# EAGLE design lamp-a-1 (EAGLE 9.6.2)
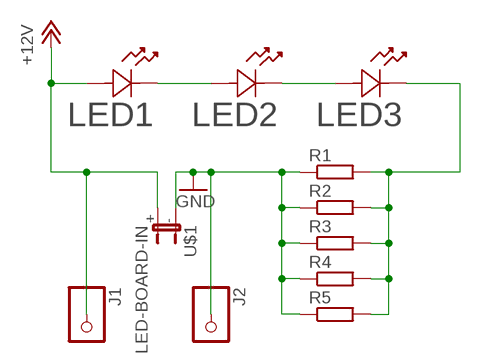
[diagram p0: schematic, sheet 1]

## Parts
J1  LARGE-SOLDERPAD  [LARGE-SOLDERPAD]
J2  LARGE-SOLDERPAD  [LARGE-SOLDERPAD]
LED1  LED-2835LED_J2835_CRW-M  [LED_J2835_CRW-M]
LED2  LED-2835LED_J2835_CRW-M  [LED_J2835_CRW-M]
LED3  LED-2835LED_J2835_CRW-M  [LED_J2835_CRW-M]
R1  R-EU_R0805  [R0805]
R2  R-EU_R0805  [R0805]
R3  R-EU_R0805  [R0805]
R4  R-EU_R0805  [R0805]
R5  R-EU_R0805  [R0805]
U$1  LED-BOARD-IN  [LED-BOARD-IN]

## Nets
+12V: J1.P$1 LED1.2 U$1.+
GND: J2.P$1 R1.1 R2.1 R3.1 R4.1 R5.1 U$1.-
N$1: LED1.1 LED2.2
N$2: LED2.1 LED3.2
N$4: LED3.1 R1.2 R2.2 R3.2 R4.2 R5.2

## Library data of the parts
J1 J2 = eagleparts:LARGE-SOLDERPAD
LED1-LED3 = eagleparts:LED-2835; COPYRIGHT: Copyright (C) 2024 Ultra Librarian. All rights reserved.; MANUFACTURER_PART_NUMBER: JB2835AWT-W-U30GA0000-N0000001; MFR_NAME: Wolfspeed
R1-R5 = rcl:R-EU_: RESISTOR, European symbol; SPICEPREFIX: R
U$1 = eagleparts:LED-BOARD-IN

## Board
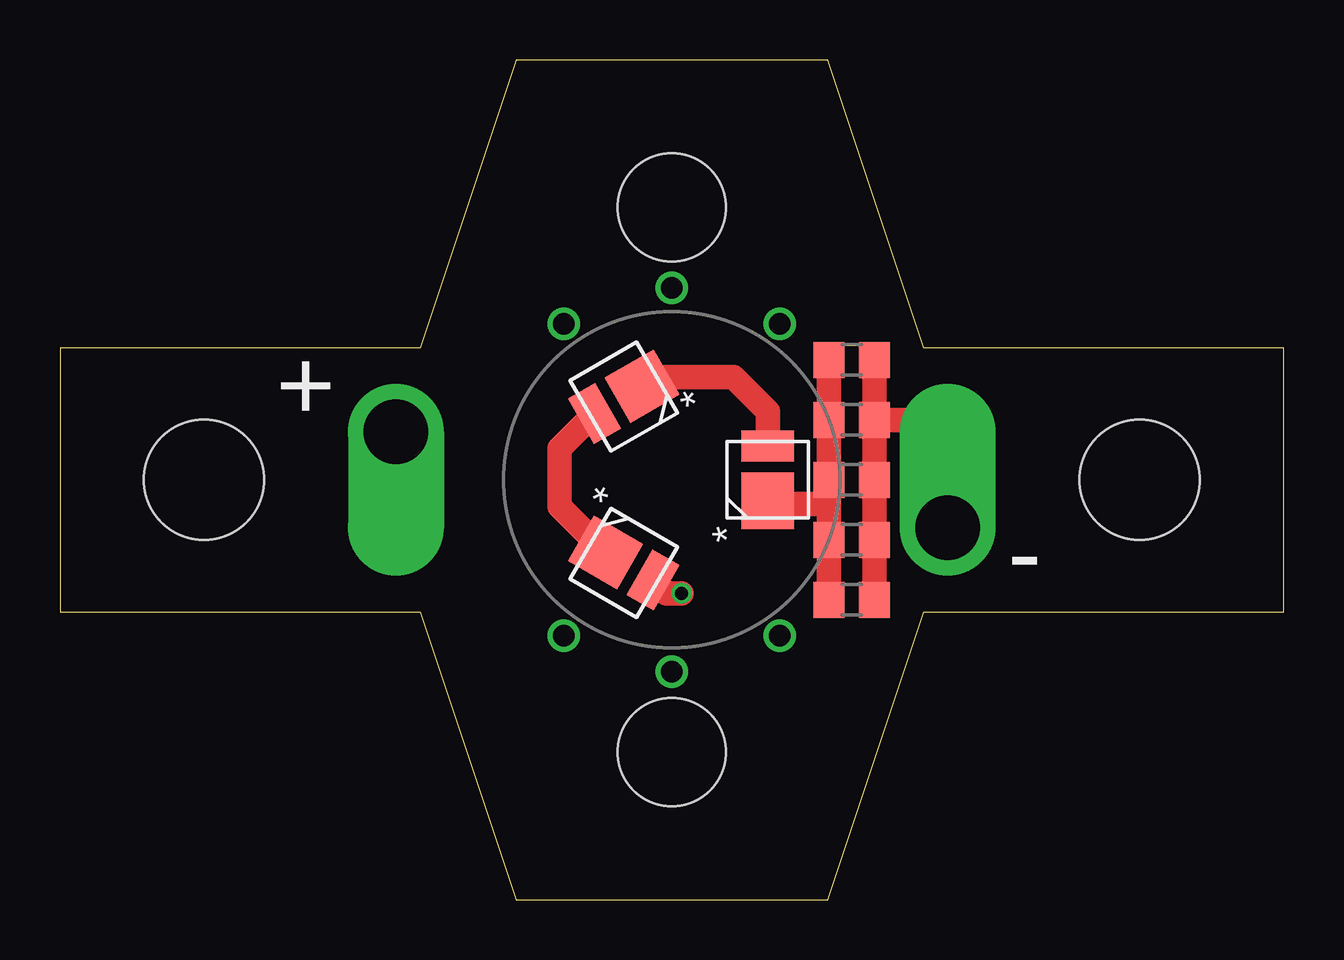
[diagram p1: board, top side]
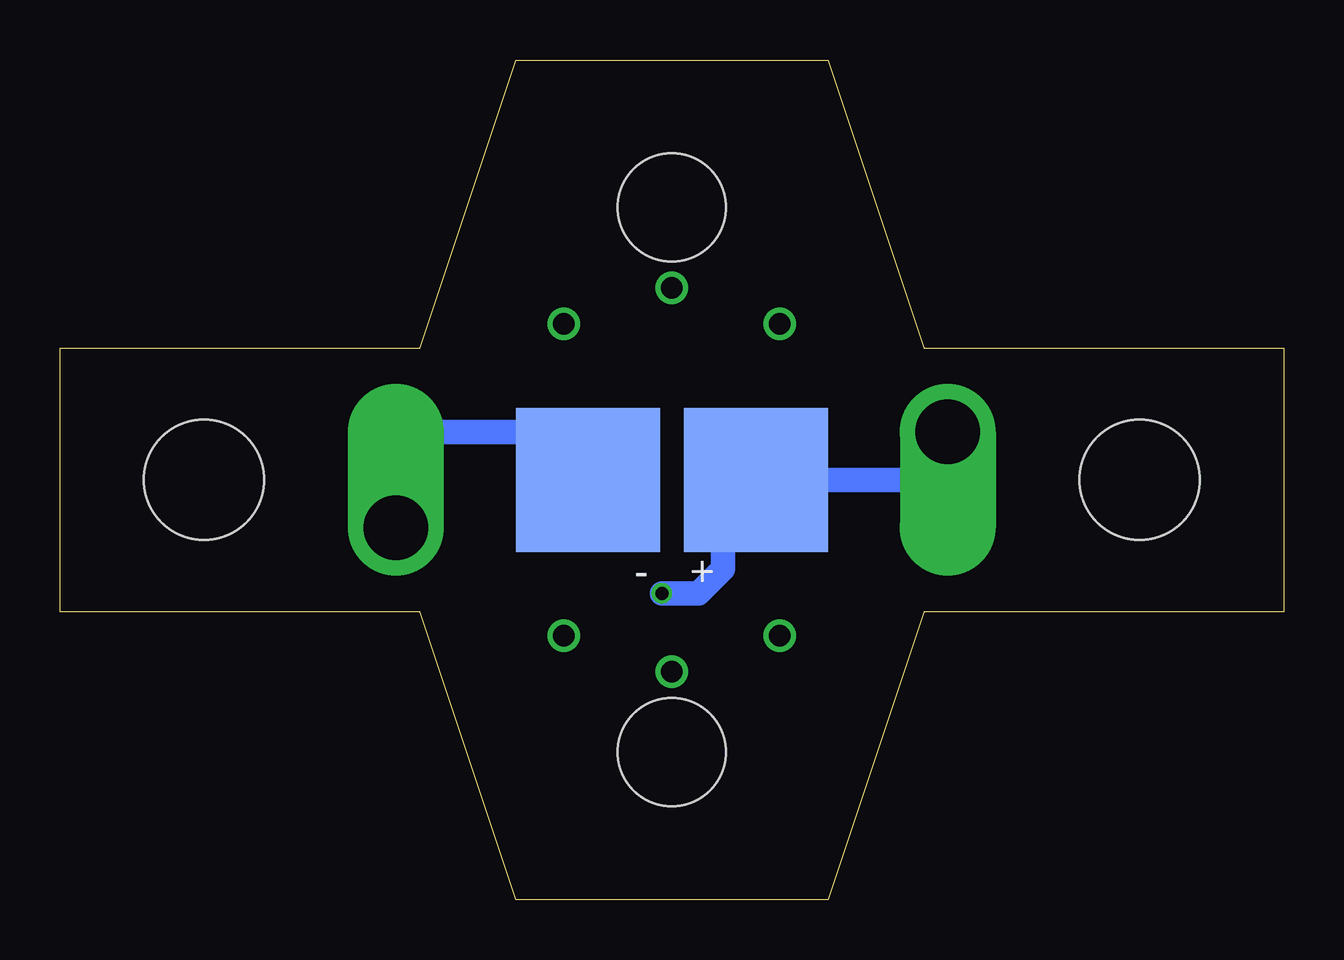
[diagram p2: board, bottom side, seen from below]

Size 51 x 35 mm. Coordinates in mm from the lower left corner, seen from the top.
Outline: 0,12 15,12 19,0 32,0 36,12 51,12 51,23 36,23 32,35 19,35 15,23 0,23 0,12
Copper layers (1*16): Top 0.035mm / dielectric 1.5mm / Bottom 0.035mm
Design rules "SeeedStudio_2layer_DRU_no_angle_20140221": minimum track width 6mil, minimum drill 12mil, track to track 6mil, track to pad 6mil, pad to pad 6mil, via to via 6mil, smd to smd 0mil, copper to edge 10mil, drill to drill 10mil, minimum pad ring 10mil, minimum via ring 6mil, stop-mask expansion 2mil, vias tented up to drill 100mil, thermal gap 10mil
Holes 5 mm at 6,17.5 45,17.5
Holes 4.5 mm at 25.5,28.85 25.5,6.15

### Footprints (pad centres in the part's own frame; a part is rotated, then mirrored left to right if it is on the bottom)
LARGE-SOLDERPAD = drill 2.7 pad 4 offset: P$1 0,0
LED_J2835_CRW-M = smd 2.362 x 2.18: 1 -0.876,0 | smd 1.295 x 2.18: 2 1.41,0
R0805 = smd 1.3 x 1.5: 1 -0.95,0; 2 0.95,0
LED-BOARD-IN = smd 6 x 6: + -3.5,0; - 3.5,0

### Placement (x,y rotation side)
J1  14,19.5 180 top
J2  37,15.5 0 top
LED1  23.5,14.03 330 top
LED2  23.5,20.96 210 top
LED3  29.5,17.5 90 top
R1  33,17.5 180 top
R2  33,15 180 top
R3  33,20 180 top
R4  33,22.5 180 top
R5  33,12.5 180 top
U$1  25.5,17.5 180 bottom

### Tracks (layer width: path | path; a pad name or v marks a point on that pad's centre or on a via)
+12V  (via drill 0.55)
  Top 1.016: v25.91,12.76 25.28,12.76 LED1.2
  Bottom 1.016: v25.91,12.76 24.38,12.76 23.37,13.78 23.37,16.13 U$1.+ 14,17.5 J1.P$1
GND
  Top 1.016: R3.1 R1.1 R2.1 R5.1 | R3.1 37,20 J2.P$1 | R4.1 R3.1
  Bottom 1.016: 31.24,19.87 29,17.63 U$1.- 31,19.5 37,19.5 J2.P$1
N$1
  Top 1.016: LED1.1 20.83,16.38 20.83,18.8 LED2.2
N$2
  Top 1.016: LED2.1 24.64,21.78 28.07,21.78 29.5,20.35 LED3.2
N$3  (via drill 0.9)
  other vias: 30,24
N$4
  Top 1.016: 29.57,16.55 LED3.1 29.62,16.5 32.05,16.5 | 32.05,16.5 R1.2 R3.2 R4.2 | 32.05,16.5 R2.2 R5.2
N$5  (via drill 0.9)
  other vias: 25.5,25.5
N$6  (via drill 0.9)
  other vias: 21,24
N$7  (via drill 0.9)
  other vias: 21,11
N$8  (via drill 0.9)
  other vias: 30,11
N$9  (via drill 0.9)
  other vias: 25.5,9.5

### Text on the board
tNames: + | -